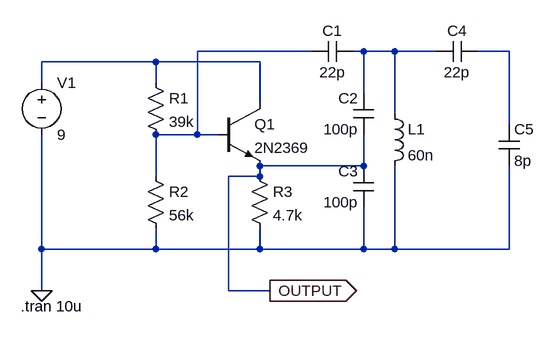
[diagram p0: schematic colpitts.asc]
colpitts.asc, the LTspice schematic file:
Version 4
SHEET 1 880 680
WIRE 160 112 -16 112
WIRE 240 112 224 112
WIRE 288 112 240 112
WIRE 352 112 288 112
WIRE 464 112 416 112
WIRE -80 128 -256 128
WIRE 80 128 -80 128
WIRE -256 160 -256 128
WIRE -80 160 -80 128
WIRE 240 176 240 112
WIRE 80 192 80 128
WIRE 288 208 288 112
WIRE 464 224 464 112
WIRE -16 240 -16 112
WIRE -16 240 -80 240
WIRE 16 240 -16 240
WIRE 240 288 240 240
WIRE 240 288 80 288
WIRE -80 304 -80 240
WIRE 80 304 80 288
WIRE 80 304 32 304
WIRE -256 416 -256 240
WIRE -80 416 -80 384
WIRE -80 416 -256 416
WIRE 80 416 80 384
WIRE 80 416 -80 416
WIRE 240 416 240 352
WIRE 240 416 80 416
WIRE 288 416 288 288
WIRE 288 416 240 416
WIRE 464 416 464 288
WIRE 464 416 288 416
WIRE -256 480 -256 416
WIRE 32 480 32 304
WIRE 96 480 32 480
FLAG -256 480 0
FLAG 96 480 OUTPUT
IOPIN 96 480 Out
SYMBOL voltage -256 144 R0
WINDOW 123 0 0 Left 0
WINDOW 39 0 0 Left 0
SYMATTR InstName V1
SYMATTR Value 9
SYMBOL res -96 144 R0
SYMATTR InstName R1
SYMATTR Value 39k
SYMBOL res -96 288 R0
SYMATTR InstName R2
SYMATTR Value 56k
SYMBOL res 64 288 R0
SYMATTR InstName R3
SYMATTR Value 4.7k
SYMBOL npn 16 192 R0
SYMATTR InstName Q1
SYMATTR Value 2N2369
SYMBOL cap 224 96 R90
WINDOW 0 0 32 VBottom 2
WINDOW 3 32 32 VTop 2
SYMATTR InstName C1
SYMATTR Value 22p
SYMBOL cap 256 240 R180
WINDOW 0 24 56 Left 2
WINDOW 3 24 8 Left 2
SYMATTR InstName C2
SYMATTR Value 100p
SYMBOL cap 256 352 R180
WINDOW 0 24 56 Left 2
WINDOW 3 24 8 Left 2
SYMATTR InstName C3
SYMATTR Value 100p
SYMBOL cap 416 96 R90
WINDOW 0 0 32 VBottom 2
WINDOW 3 32 32 VTop 2
SYMATTR InstName C4
SYMATTR Value 22p
SYMBOL ind 272 192 R0
SYMATTR InstName L1
SYMATTR Value 60n
SYMBOL cap 448 224 R0
SYMATTR InstName C5
SYMATTR Value 8p
TEXT -288 504 Left 2 !.tran 10u

The netlist it stands for:
* colpitts.asc
V1 N004 0 9
R1 N004 N001 39k
R2 N001 0 56k
R3 OUTPUT 0 4.7k
Q1 N004 N001 OUTPUT 0 2N2369
C1 N002 N001 22p
C2 OUTPUT N002 100p
C3 0 OUTPUT 100p
C4 N003 N002 22p
L1 N002 0 60n
C5 N003 0 8p
.model NPN NPN
.model PNP PNP
.lib standard.bjt
.tran 10u
.backanno
.end